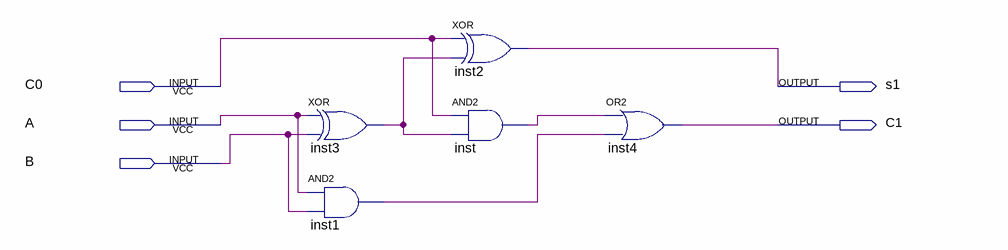
[diagram p0: schematic sheet]
// Quartus schematic fulladder.bdf as structural Verilog: 5 symbols, 5 pins
module fulladder (
  input  C0,
  input  A,
  input  B,
  output s1,
  output C1
);

  wire inst1_out, inst3_out, inst_out;

  xor inst3 (inst3_out, A, B);
  and inst1 (inst1_out, A, B);
  xor inst2 (s1, C0, inst3_out);
  and inst (inst_out, C0, inst3_out);
  or inst4 (C1, inst_out, inst1_out);
endmodule
